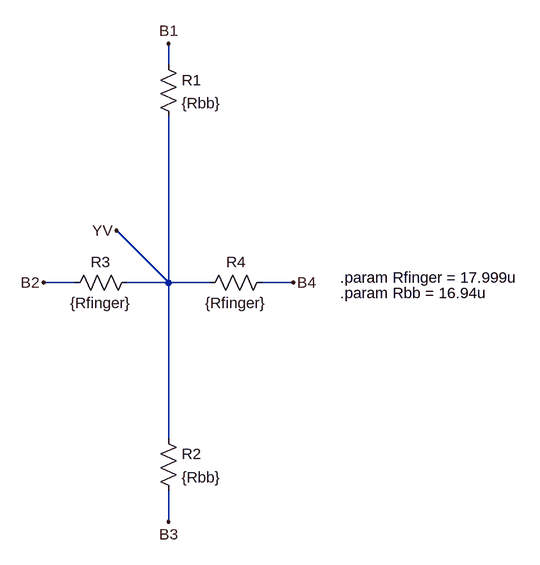
[diagram p0: schematic IVBottomElement.asc]
IVBottomElement.asc, the LTspice schematic file:
Version 4
SHEET 1 880 680
WIRE 48 -144 48 -176
WIRE -96 192 -144 192
WIRE 48 192 48 -64
WIRE 48 192 -32 112
WIRE 48 192 -16 192
WIRE 112 192 48 192
WIRE 240 192 192 192
WIRE 48 432 48 192
WIRE 48 560 48 512
FLAG 48 -176 B1
FLAG 48 560 B3
FLAG -144 192 B2
FLAG 240 192 B4
FLAG -32 112 YV
SYMBOL res 32 -160 R0
SYMATTR InstName R1
SYMATTR Value {Rbb}
SYMBOL res 32 416 R0
SYMATTR InstName R2
SYMATTR Value {Rbb}
SYMBOL res 0 176 R90
WINDOW 0 0 56 VBottom 2
WINDOW 3 32 56 VTop 2
SYMATTR InstName R3
SYMATTR Value {Rfinger}
SYMBOL res 208 176 R90
WINDOW 0 0 56 VBottom 2
WINDOW 3 32 56 VTop 2
SYMATTR InstName R4
SYMATTR Value {Rfinger}
TEXT 312 184 Left 2 !.param Rfinger = 17.999u
TEXT 312 208 Left 2 !.param Rbb = 16.94u

The netlist it stands for:
* IVBottomElement.asc
R1 B1 YV {Rbb}
R2 YV B3 {Rbb}
R3 YV B2 {Rfinger}
R4 B4 YV {Rfinger}
.param Rfinger = 17.999u
.param Rbb = 16.94u
.backanno
.end